# Altium schematic sheet ArmDebuger(7-7)-CPLD.SchDoc
size A4
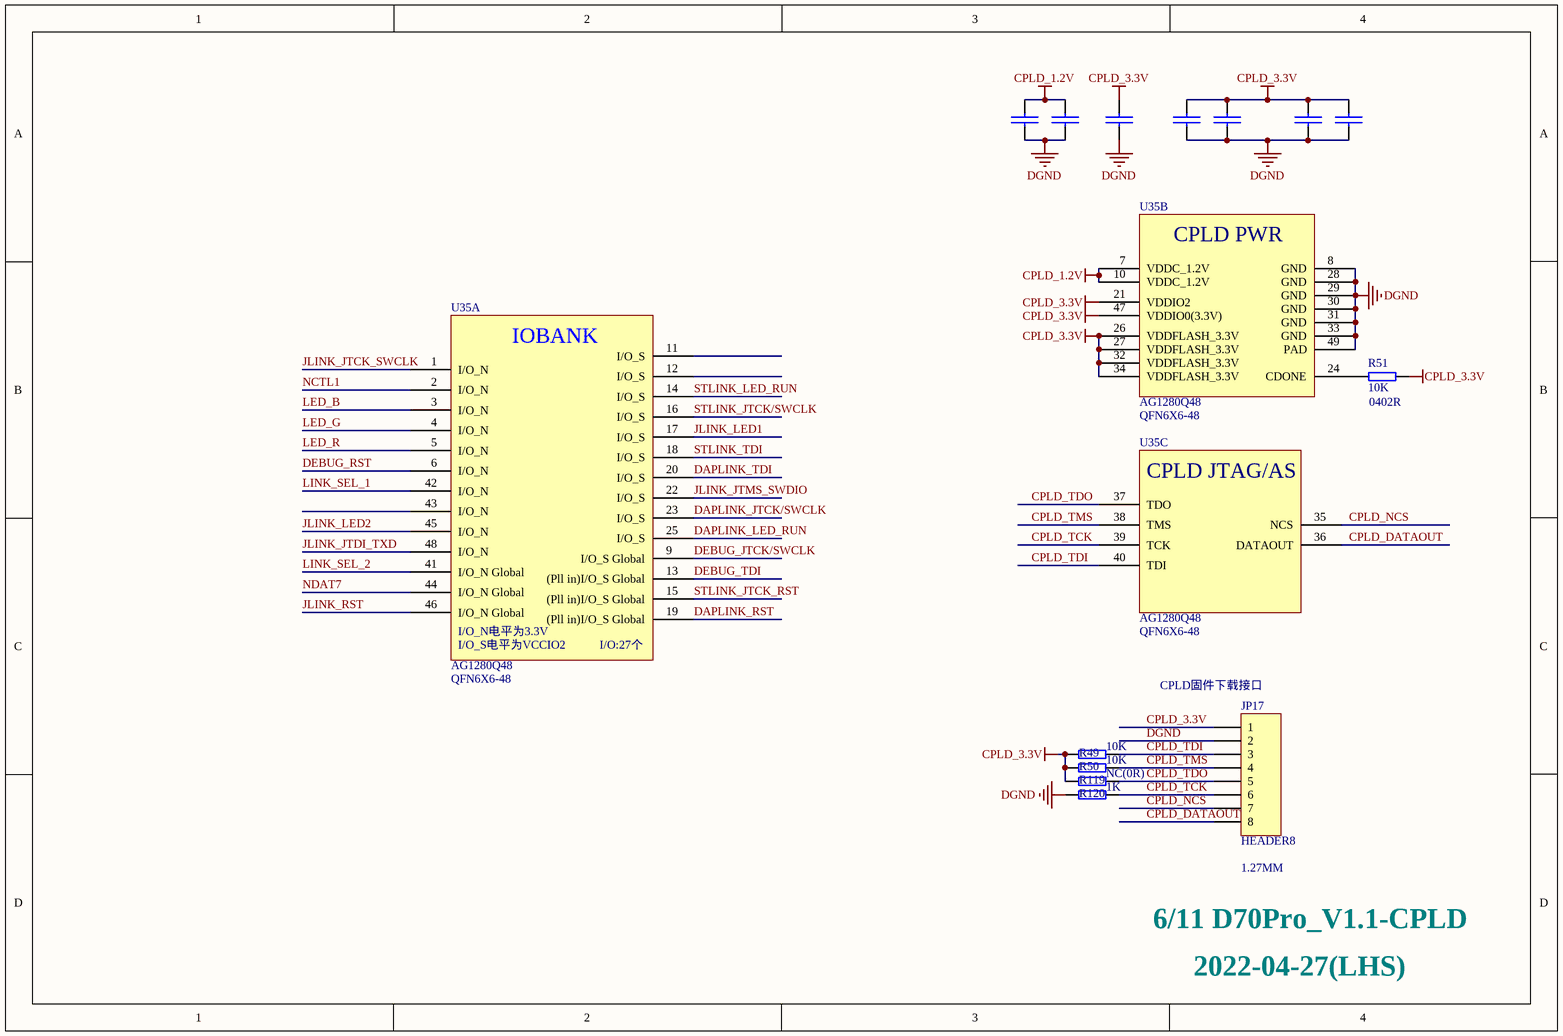
[diagram p0: ArmDebuger(7-7)-CPLD.SchDoc]

## Parts
C105  104/X7R/16V  [0402C-SMD-M]  (value not drawn)
C172  104/X7R/16V  [0402C-SMD-M]  (value not drawn)
C223  104/X7R/16V  [0402C-SMD-M]  (value not drawn)
C224  104/X7R/16V  [0402C-SMD-M]  (value not drawn)
C227  104/X7R/16V  [0402C-SMD-M]  (value not drawn)
C228  104/X7R/16V  [0402C-SMD-M]  (value not drawn)
C229  104/X7R/16V  [0402C-SMD-M]  (value not drawn)
JP17  HEADER8  Fp: 1.27MM  [HEADER4x2-1.27mm]
R49  10K  [0402R-SMD-M]
R50  10K  [0402R-SMD-M]
R51  10K  Fp: 0402R  [0402R-SMD-M]
R119  NC(0R)  [0402R-SMD-M]
R120  1K  [0402R-SMD-M]
U35  AG1280Q48  [QFN6X6-48]  (parts A,B,C of 3)

## Nets
CPLD_1.2V: C105.2 C229.1 U35.7(VDDC_1.2V) U35.10(VDDC_1.2V)
CPLD_3.3V: C172.2 C223.2 C224.2 C227.2 C228.2 JP17.1 R49.2 R50.2 R51.1 R119.2 U35.21(VDDIO2) U35.26(VDDFLASH_3.3V) U35.27(VDDFLASH_3.3V) U35.32(VDDFLASH_3.3V) U35.34(VDDFLASH_3.3V) U35.47(VDDIO0(3.3V))
DGND: C105.1 C172.1 C223.1 C224.1 C227.1 C228.1 C229.2 JP17.2 R120.2 U35.8(GND) U35.28(GND) U35.29(GND) U35.30(GND) U35.31(GND) U35.33(GND) U35.49(PAD)
CPLD_DATAOUT: JP17.8 U35.36(DATAOUT)
CPLD_NCS: JP17.7 U35.35(NCS)
CPLD_TCK: JP17.6 R120.1 U35.39(TCK)
CPLD_TDI: JP17.3 R49.1 U35.40(TDI)
CPLD_TDO: JP17.5 R119.1 U35.37(TDO)
CPLD_TMS: JP17.4 R50.1 U35.38(TMS)
DAPLINK_JTCK/SWCLK: U35.23(I/O_S)
DAPLINK_LED_RUN: U35.25(I/O_S)
DAPLINK_RST: U35.19((Pll_in)I/O_S_Global)
DAPLINK_TDI: U35.20(I/O_S)
DEBUG_JTCK/SWCLK: U35.9(I/O_S_Global)
DEBUG_RST: U35.6(I/O_N)
DEBUG_TDI: U35.13((Pll_in)I/O_S_Global)
JLINK_JTCK_SWCLK: U35.1(I/O_N)
JLINK_JTDI_TXD: U35.48(I/O_N)
JLINK_JTMS_SWDIO: U35.22(I/O_S)
JLINK_LED1: U35.17(I/O_S)
JLINK_LED2: U35.45(I/O_N)
JLINK_RST: U35.46(I/O_N_Global)
LED_B: U35.3(I/O_N)
LED_G: U35.4(I/O_N)
LED_R: U35.5(I/O_N)
LINK_SEL_1: U35.42(I/O_N)
LINK_SEL_2: U35.41(I/O_N_Global)
NCTL1: U35.2(I/O_N)
NDAT7: U35.44(I/O_N_Global)
STLINK_JTCK/SWCLK: U35.16(I/O_S)
STLINK_JTCK_RST: U35.15((Pll_in)I/O_S_Global)
STLINK_LED_RUN: U35.14(I/O_S)
STLINK_TDI: U35.18(I/O_S)
NetR51_2: R51.2 U35.24(CDONE)

Not connected (* = marked no-connect by the designer): U35 11(I/O_S) 12(I/O_S) 43(I/O_N)

## Notes on the sheet
- (near U35) I/O:27个
- (near JP17) CPLD固件下载接口
- 6/11 D70Pro_V1.1-CPLD
- 2022-04-27(LHS)
- (in symbol AG1280Q48, part A) IOBANK; I/O_N电平为3.3V; I/O_S电平为VCCIO2
- (in symbol AG1280Q48, part B) CPLD PWR
- (in symbol AG1280Q48, part C) CPLD JTAG/AS

## Library data of the parts
C105 C172 C223 C224 C227-C229 = CAP: Fp: 0402C; P/N: 06075; LCSC: C60474
R49 R50 = RES: Fp: 0402R; P/N: 04120; LCSC: C25744
R51 = RES: P/N: 04120; LCSC: C25744
R119 = RES: Fp: 0402R; P/N: NC(04150); LCSC: NC
R120 = RES: Fp: 0402R; P/N: 04123; LCSC: C11702
JP17 = HEADER8: LCSC: NC
U35 = AG1280Q48: Fp: QFN6X6-48; P/N: ?; taobao: https://m.tb.cn/h.5UjIJER?tk=o2YQWaF6f0s